# Altium schematic sheet Power.SchDoc
size A3; SheetNumber: 5; SheetTotal: 5
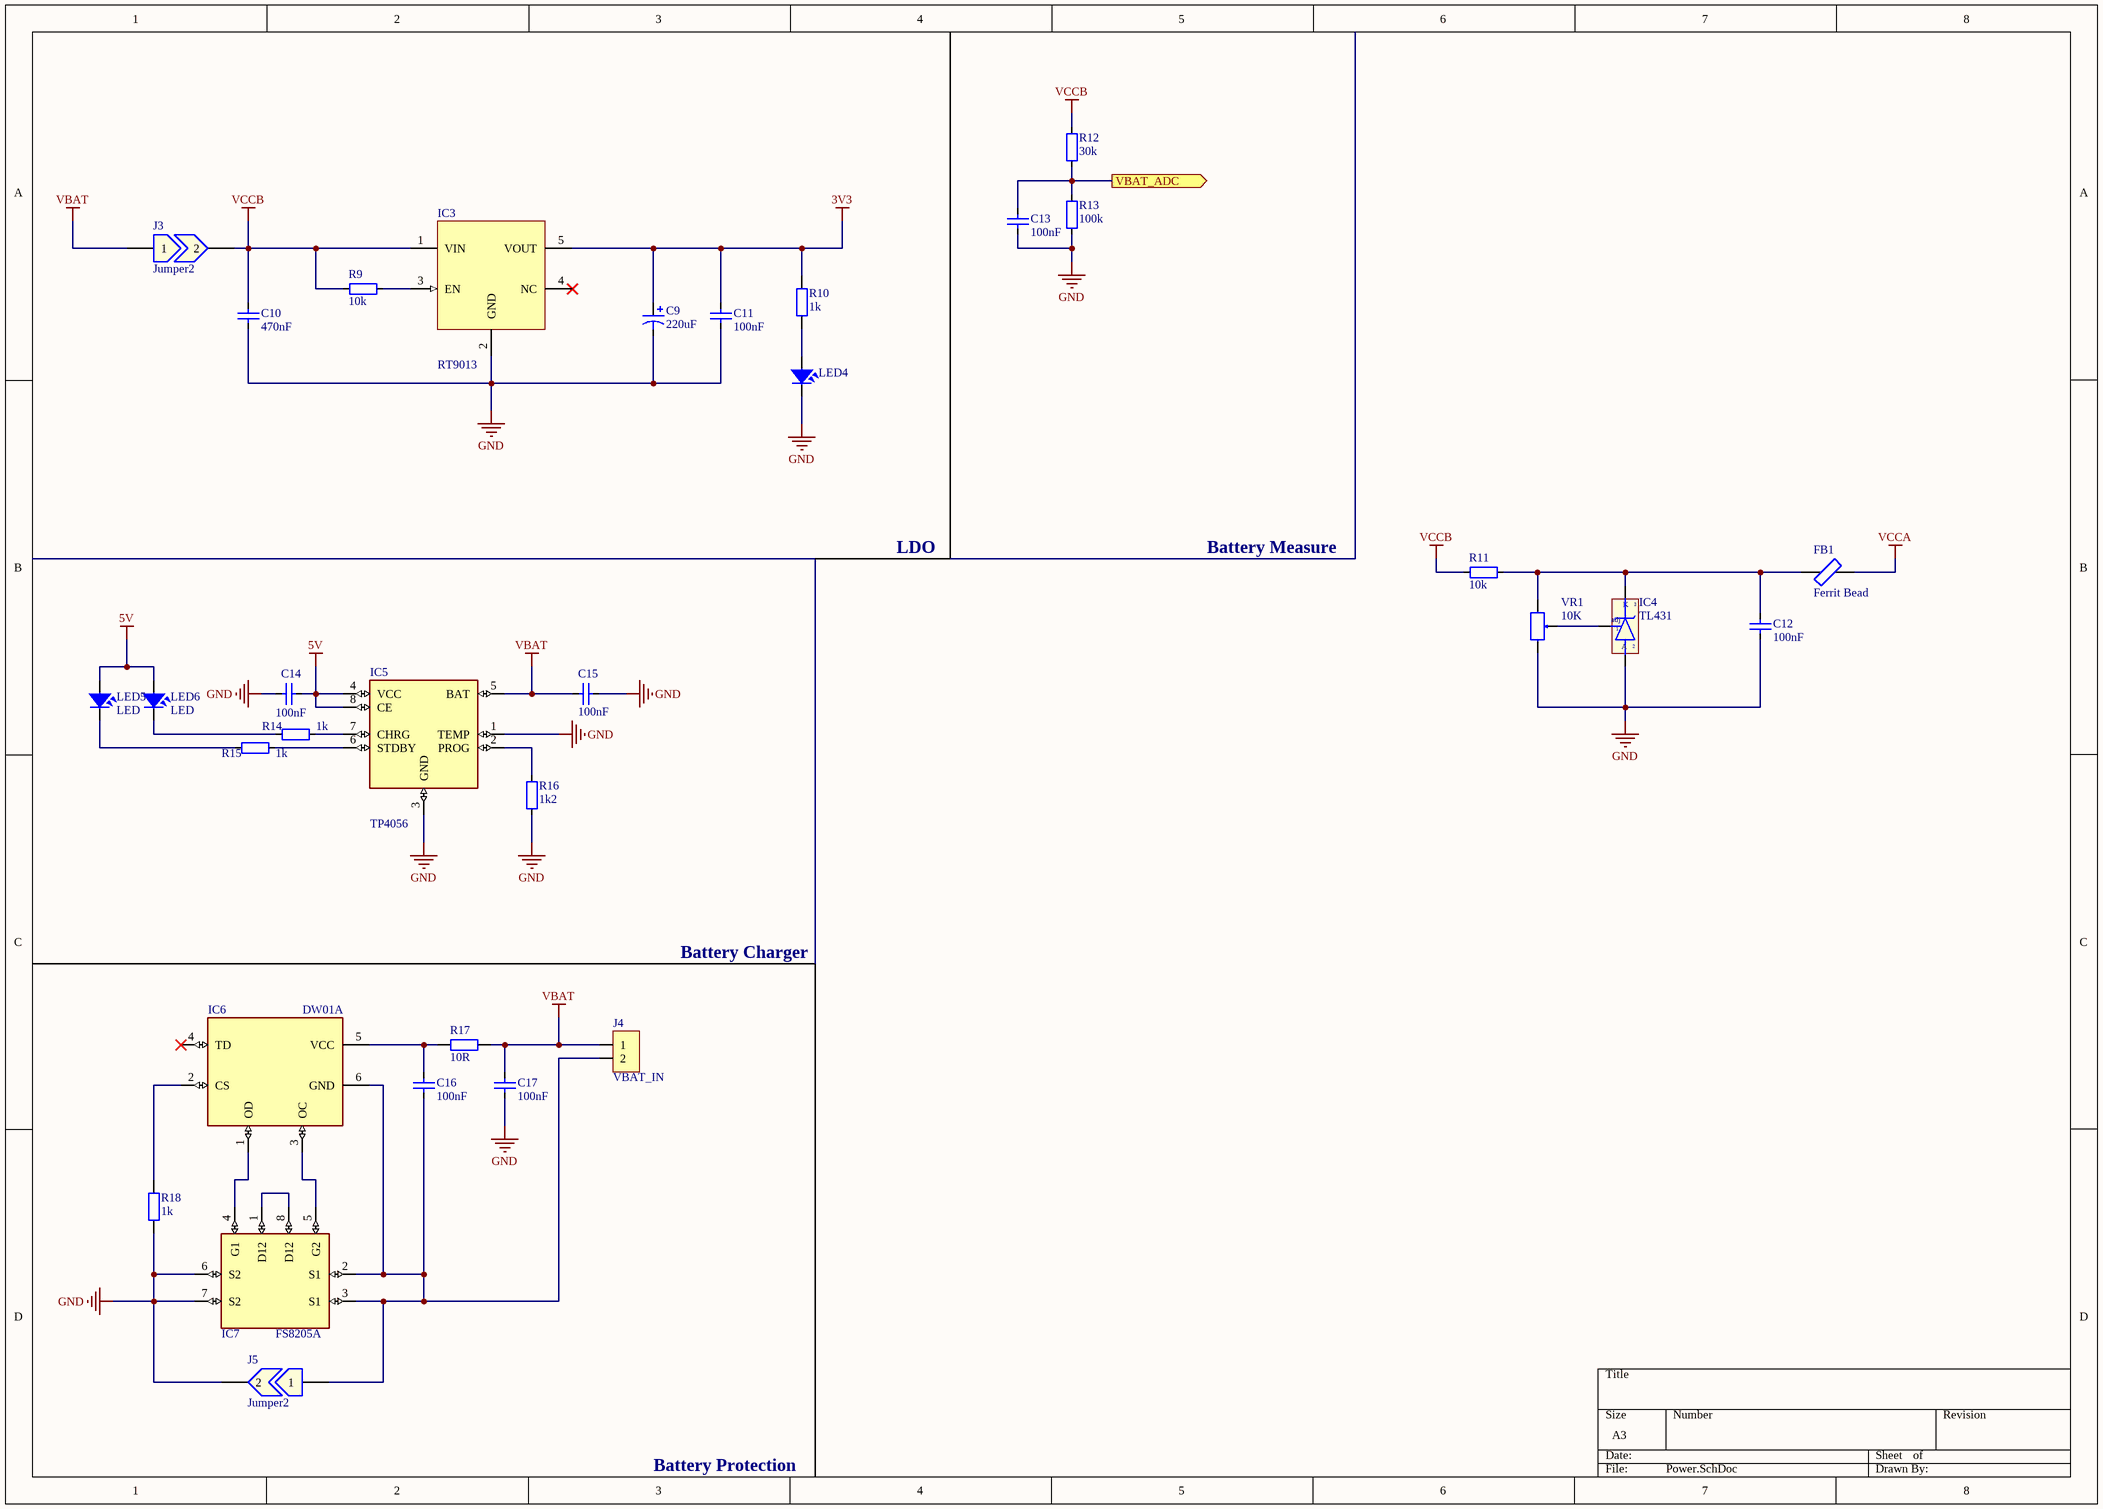
[diagram p0: Power.SchDoc]

## Parts
C9  220uF  [CAP_TANTALUM_3216]
C10  470nF  [CAP_0805]
C11  100nF  [CAP_0805]
C12  100nF  [CAP_0805]
C13  100nF  [CAP_0805]
C14  100nF  [CAP_0805]
C15  100nF  [CAP_0805]
C16  100nF  [CAP_0805]
C17  100nF  [CAP_0805]
FB1  Ferrit Bead  [RES-SMD-0805]
IC3  RT9013  [SOT23-5]
IC4  TL431  [qto-92]
IC5  TP4056  [TP4056]
IC6  DW01A  [SOT23-6]
IC7  FS8205A  [FS8205A]
J3  Jumper2  [JUMPER2]
J4  VBAT_IN  [JP2-D1T]
J5  Jumper2  [JUMPER2]
LED4  (no value)  [LED-0805-Red]
LED5  LED  [LED-0805-Red]
LED6  LED  [LED-0805-Green]
R9  10k  [RES-SMD-0805]
R10  1k  [RES-SMD-0805]
R11  10k  [RES-SMD-0805]
R12  30k  [RES-SMD-0805]
R13  100k  [RES-SMD-0805]
R14  1k  [RES-SMD-0805]
R15  1k  [RES-SMD-0805]
R16  1k2  [RES-SMD-0805]
R17  10R  [RES-SMD-0805]
R18  1k  [RES-SMD-0805]
VR1  10K  [VR1]

## Ports
VBAT_ADC (out)

## Nets
3V3: C9.1 C11.1 IC3.5(VOUT) R10.2
5V: C14.1 IC5.4(VCC) IC5.8(CE) LED5.1 LED6.1
GND: C9.2 C10.2 C11.2 C12.2 C13.1 C14.2 C15.1 C17.1 IC3.2(GND) IC4.2(A) IC5.1(TEMP) IC5.3(GND) IC7.6(S2) IC7.7(S2) J5.2 LED4.2 R13.2 R16.1 R18.2 VR1.3
VBAT: C15.2 C17.2 IC5.5(BAT) J3.1 J4.1 R17.2
VCCA: FB1.2
VCCB: C10.1 IC3.1(VIN) J3.2 R9.2 R11.2 R12.1
VBAT_ADC: C13.2 R12.2 R13.1 ; port VBAT_ADC
NetC12_1: C12.1 FB1.1 IC4.3(K) R11.1 VR1.1
NetC16_1: C16.1 IC6.6(GND) IC7.2(S1) IC7.3(S1) J4.2 J5.1
NetC16_2: C16.2 IC6.5(VCC) R17.1
NetIC3_3: IC3.3(EN) R9.1
NetIC4_1: IC4.1(adj) VR1.2
NetIC5_2: IC5.2(PROG) R16.2
NetIC5_6: IC5.6(STDBY) R15.1
NetIC5_7: IC5.7(CHRG) R14.1
NetIC6_1: IC6.1(OD) IC7.4(G1)
NetIC6_2: IC6.2(CS) R18.1
NetIC6_3: IC6.3(OC) IC7.5(G2)
NetIC7_1: IC7.1(D12) IC7.8(D12)
NetLED4_1: LED4.1 R10.1
NetLED5_2: LED5.2 R15.2
NetLED6_2: LED6.2 R14.2

Not connected (* = marked no-connect by the designer): IC3 4(NC)*; IC6 4(TD)*

## Notes on the sheet
- LDO
- Battery Measure
- Battery Charger
- Battery Protection

## Library data of the parts
C9 = Cap Pol: Polarized Capacitor (Axial); Published: 8-Jun-2000; LatestRevisionDate: 17-Jul-2002; LatestRevisionNote: Re-released for DXP Platform.; PackageReference: POLAR0.8; Publisher: Altium Limited
C10-C17 = CapSMD: Capacitor; Value: 33p; Published: 8-Jun-2000; LatestRevisionDate: 17-Jul-2002; LatestRevisionNote: Re-released for DXP Platform.; PackageReference: RAD-0.3; Publisher: Altium Limited
FB1 = Ferrit Bead: Generic Ferrit Bead
IC3 = RT9013: https://linhkien.cxt.vn/5435-rt9013-33gb-ic-reg-linear-33v-500ma-sot23-5.html
IC4 = TL431: Programmable Shunt Regulator; Value: TL431
IC5 = TP4056: Complete single cell Li-Ion battery with a constant current / constant voltage linear charger
IC6 = DW01A: One Cell Lithium-ion/Polymer Battery Protection IC
J3 J5 = Jumper2: Jumper, 2-Pin
J4 = JP2: WR-PHD 2.54 mm Angled Socket Header; Manufacturer: W¨¹rth Elektronik eiSos GmbH; partNo: 613002143121; ComponentLink1 Description: Manufacturer; ComponentLink2 Description: Datasheet; NoPins: 02; Created Date: 29 March 2013; ComponentLink1URL: http://www.we-online.com; ComponentLink2URL: http://katalog.we-online.de/em/datasheet/6130xx143121.pdf; Created by: Karrer Zheng
LED4-LED6 = LED: LED Single colour Green and Red; Value: LED 3 ly Single Colour
R9 R11-R16 = Resistor - SMD: Resistor; Manufacturer: Generic Components; Class: Passive; Published: 08/06/2000; Publisher: Altium Hobart Technology Centre
R10 R17 R18 = Resistor - SMD: Resistor SMD; Manufacturer: Generic Components; Class: Passive; Published: 08/06/2000; Publisher: Altium Hobart Technology Centre
VR1 = VR: Var Resistor; Value: VR 10K